# EAGLE schematic qcopter_joystick (EAGLE 7.5.0)
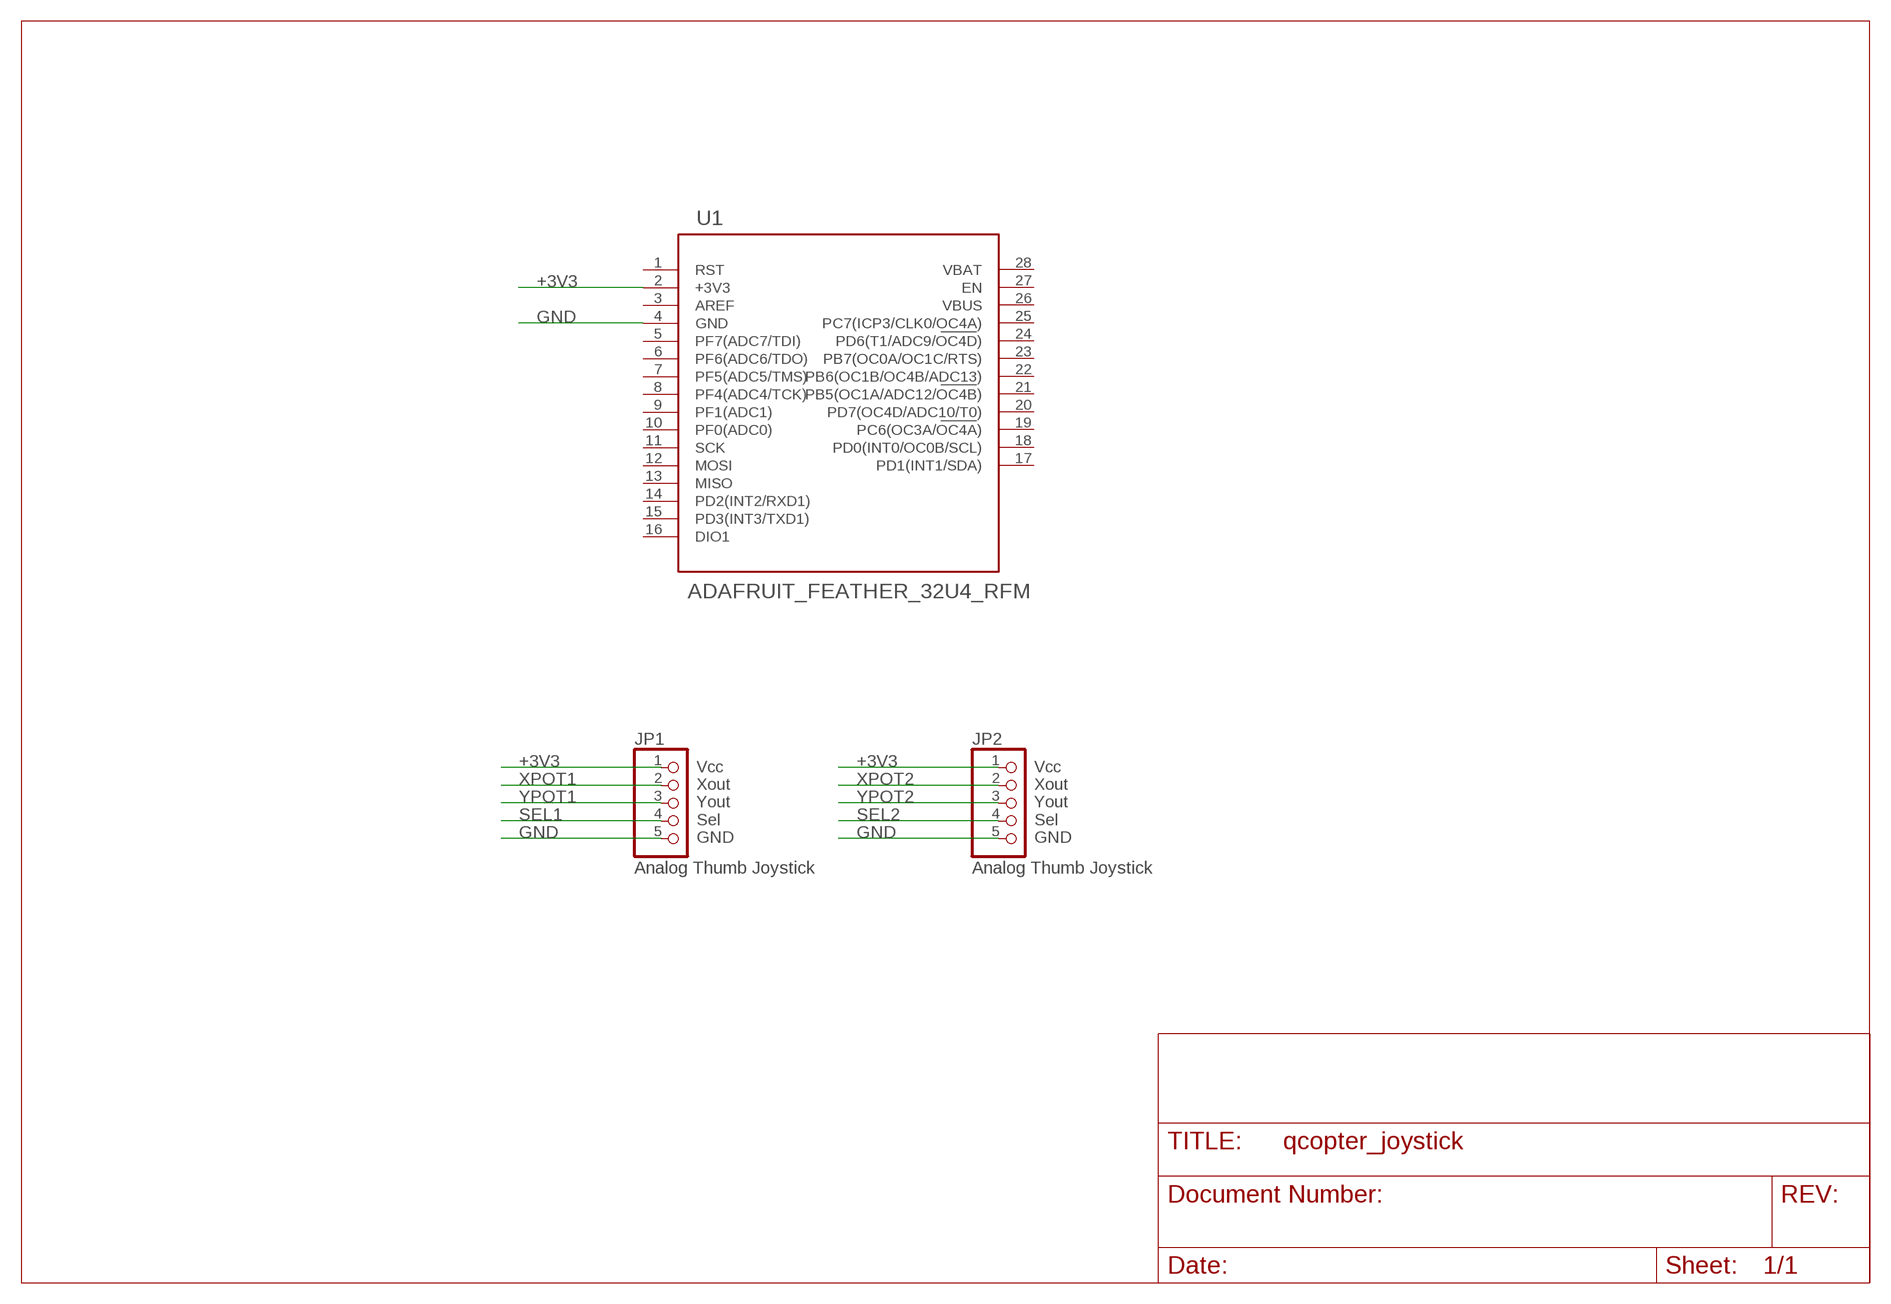
[diagram p0: schematic, sheet 1]

## Parts
JP1  Analog Thumb Joystick  PINHD-1X5  [1X05]
JP2  Analog Thumb Joystick  PINHD-1X5  [1X05]
U1  ADAFRUIT_FEATHER_32U4_RFM  [ADAFRUIT_FEATHER_32U4_RFM]

## Nets
+3V3: JP1.1 JP2.1 U1.2(+3V3)
GND: JP1.5 JP2.5 U1.4(GND)
SEL1: JP1.4
SEL2: JP2.4
XPOT1: JP1.2
XPOT2: JP2.2
YPOT1: JP1.3
YPOT2: JP2.3
Unconnected: U1.1(RST) U1.3(AREF) U1.5(PF7(ADC7/TDI)) U1.6(PF6(ADC6/TDO)) U1.7(PF5(ADC5/TMS)) U1.8(PF4(ADC4/TCK)) U1.9(PF1(ADC1)) U1.10(PF0(ADC0)) U1.11(SCK) U1.12(MOSI) U1.13(MISO) U1.14(PD2(INT2/RXD1)) U1.15(PD3(INT3/TXD1)) U1.16(DIO1) U1.17(PD1(INT1/SDA)) U1.18(PD0(INT0/OC0B/SCL)) U1.19(PC6(OC3A/OC4A)) U1.20(PD7(OC4D/ADC10/T0)) U1.21(PB5(OC1A/ADC12/OC4B)) U1.22(PB6(OC1B/OC4B/ADC13)) U1.23(PB7(OC0A/OC1C/RTS)) U1.24(PD6(T1/ADC9/OC4D)) U1.25(PC7(ICP3/CLK0/OC4A)) U1.26(VBUS) U1.27(EN) U1.28(VBAT)

## Notes on the sheet
- Vcc
  Xout
  Yout
  Sel
  GND
- Vcc
  Xout
  Yout
  Sel
  GND

## Library data of the parts
JP1 JP2 = pinhead:PINHD-1X5: PIN HEADER
U1 = Adafruit Feather 32u4 RFM:ADAFRUIT_FEATHER_32U4_RFM: Adafruit Feather 32u4 RFM95 LoRa Radio - 868 or 915 MHz